# Altium schematic sheet Main.SchDoc
size A4
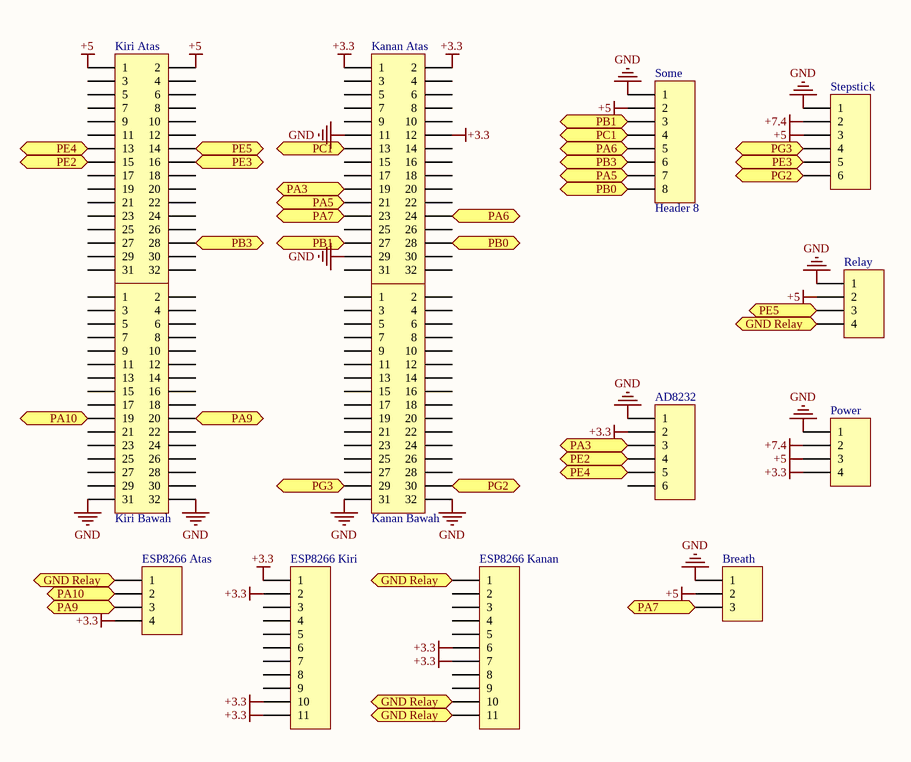
[diagram p0: Main.SchDoc]

## Parts
AD8232  (no value)  [HDR1X6]
ESP8266_Atas  (no value)  [HDR1X4]
ESP8266_Kanan  (no value)  [HDR1X11]
ESP8266_Kiri  (no value)  [HDR1X11]
Kanan_Atas  (no value)  [HDR2X16]
Kanan_Bawah  (no value)  [HDR2X16]
Kiri_Atas  (no value)  [HDR2X16]
Kiri_Bawah  (no value)  [HDR2X16]
o  Breath  [My_1X03]
Power  Header 4  [My_1X04]  (value not drawn)
Relay  Header 4  [My_1X04]  (value not drawn)
Some  Header 8  [HDR1X8]
Stepstick  Header 6  [My_1X06]  (value not drawn)

## Ports
GND Relay (bidir), PA3 (in), PA3 (out), PA5 (in), PA5 (out), PA6 (in), PA6 (out), PA7, PA9 (in), PA9 (out), PA10 (in), PA10 (out), PB0 (in), PB0 (out), PB1 (in), PB1 (out), PB3 (in), PB3 (out), PC1 (in), PC1 (out), PE2 (in), PE2 (out), PE3 (in), PE3 (out), PE4 (in), PE4 (out), PE5 (in), PE5 (out), PG2 (in), PG2 (out), PG3 (in), PG3 (out)

## Nets
+3.3: AD8232.2 ESP8266_Atas.4 ESP8266_Kanan.6 ESP8266_Kanan.7 ESP8266_Kiri.1 ESP8266_Kiri.2 ESP8266_Kiri.10 ESP8266_Kiri.11 Kanan_Atas.1 Kanan_Atas.2 Kanan_Atas.12 Power.4
+5: Kiri_Atas.1 Kiri_Atas.2 o.2 Power.3 Relay.2 Some.2 Stepstick.3
+7.4: Power.2 Stepstick.2
GND: AD8232.1 Kanan_Atas.11 Kanan_Atas.29 Kanan_Bawah.31 Kanan_Bawah.32 Kiri_Bawah.31 Kiri_Bawah.32 o.1 Power.1 Relay.1 Some.1 Stepstick.1
GND Relay: ESP8266_Atas.1 ESP8266_Kanan.1 ESP8266_Kanan.10 ESP8266_Kanan.11 Relay.4 ; port GND Relay
PA3: AD8232.3 Kanan_Atas.19 ; port PA3
PA5: Kanan_Atas.21 Some.7 ; port PA5
PA6: Kanan_Atas.24 Some.5 ; port PA6
PA7: Kanan_Atas.23 o.3 ; port PA7
PA9: ESP8266_Atas.3 Kiri_Bawah.20 ; port PA9
PA10: ESP8266_Atas.2 Kiri_Bawah.19 ; port PA10
PB0: Kanan_Atas.28 Some.8 ; port PB0
PB1: Kanan_Atas.27 Some.3 ; port PB1
PB3: Kiri_Atas.28 Some.6 ; port PB3
PC1: Kanan_Atas.13 Some.4 ; port PC1
PE2: AD8232.4 Kiri_Atas.15 ; port PE2
PE3: Kiri_Atas.16 Stepstick.5 ; port PE3
PE4: AD8232.5 Kiri_Atas.13 ; port PE4
PE5: Kiri_Atas.14 Relay.3 ; port PE5
PG2: Kanan_Bawah.30 Stepstick.6 ; port PG2
PG3: Kanan_Bawah.29 Stepstick.4 ; port PG3

Not connected (* = marked no-connect by the designer): AD8232 6; ESP8266_Kanan 2 3 4 5 8 9; ESP8266_Kiri 3 4 5 6 7 8 9; Kanan_Atas 3 4 5 6 7 8 9 10 14 15 16 17 18 20 22 25 26 30 31 32; Kanan_Bawah 1 2 3 4 5 6 7 8 9 10 11 12 13 14 15 16 17 18 19 20 21 22 23 24 25 26 27 28; Kiri_Atas 3 4 5 6 7 8 9 10 11 12 17 18 19 20 21 22 23 24 25 26 27 29 30 31 32; Kiri_Bawah 1 2 3 4 5 6 7 8 9 10 11 12 13 14 15 16 17 18 21 22 23 24 25 26 27 28 29 30

## Library data of the parts
AD8232 Stepstick = Header 6: Header, 6-Pin; LatestRevisionDate: 17-Jul-2002; LatestRevisionNote: Re-released for DXP Platform.; Publisher: Altium Limited
ESP8266_Atas Power Relay = Header 4: Header, 4-Pin; LatestRevisionDate: 17-Jul-2002; LatestRevisionNote: Re-released for DXP Platform.; Publisher: Altium Limited
ESP8266_Kanan ESP8266_Kiri = Header 11: Header, 11-Pin; LatestRevisionDate: 17-Jul-2002; LatestRevisionNote: Re-released for DXP Platform.; Publisher: Altium Limited
Kanan_Atas Kanan_Bawah Kiri_Atas Kiri_Bawah = Header 16X2: Header, 16-Pin, Dual row; LatestRevisionDate: 17-Jul-2002; LatestRevisionNote: Re-released for DXP Platform.; Publisher: Altium Limited
o = Header 3: Header, 3-Pin; LatestRevisionDate: 17-Jul-2002; LatestRevisionNote: Re-released for DXP Platform.; Publisher: Altium Limited
Some = Header 8: Header, 8-Pin; LatestRevisionDate: 17-Jul-2002; LatestRevisionNote: Re-released for DXP Platform.; Publisher: Altium Limited